# Altium schematic sheet Alimentacion.SchDoc
size A4
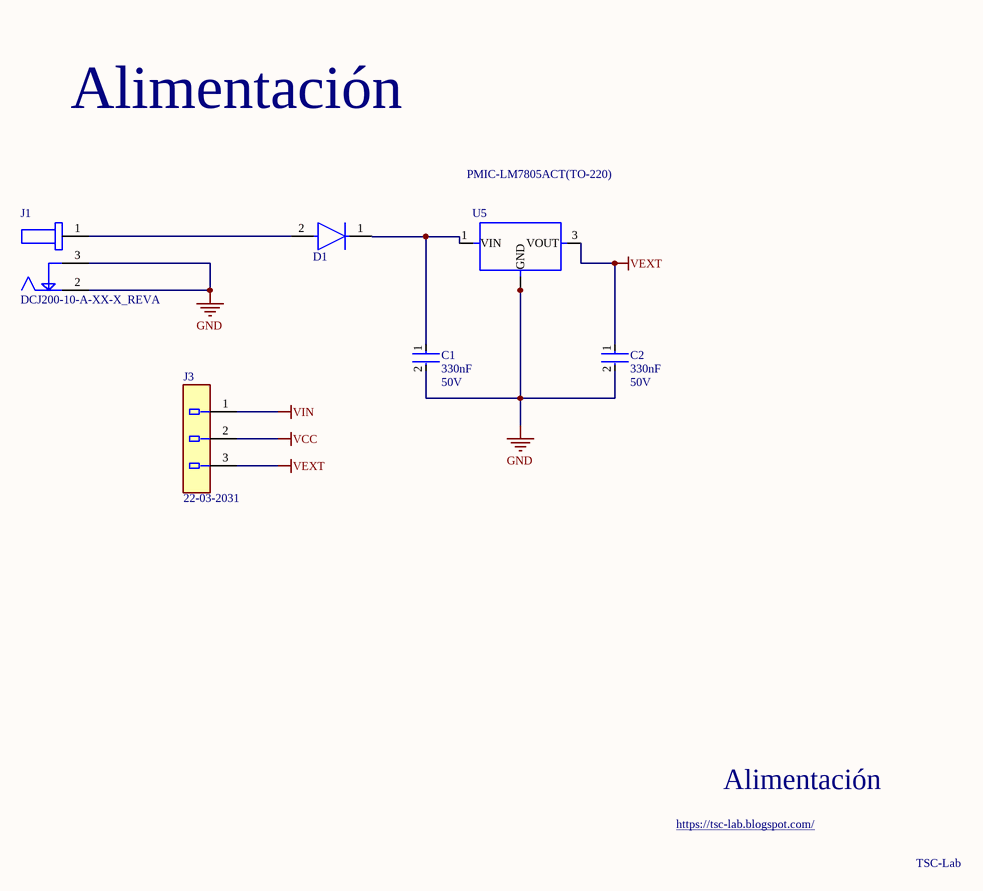
[diagram p0: Alimentacion.SchDoc]

## Parts
C1  Capacitance: 330nF  Voltage: 50V  [Kemet_C322C334M5U5TA7301_0]  (hidden comment: Cap_Kemet_C322C334M5U5TA7301_eec)
C2  Capacitance: 330nF  Voltage: 50V  [Kemet_C322C334M5U5TA7301_0]  (hidden comment: Cap_Kemet_C322C334M5U5TA7301_eec)
D1  Diode_Vishay_1N4001E-E3-54_eec  [Vishay_1N4001E-E3-54_0]  (value not drawn)
J1  DCJ200-10-A-XX-X_REVA  [GCT_DCJ200-10-A-XX-X_REVA]
J3  Part Number: 22-03-2031  [Molex_SD-4030-0001_0]  (hidden comment: Conn_Molex_22-03-2031_eec)
U5  PMIC-LM7805ACT(TO-220)  [TO-220]

## Nets
GND: C1.2 C2.2 J1.2 J1.3 U5.2(GND) U5.HEAT(GND)
VCC: J3.2
VEXT: C2.1 J3.3 U5.3(VOUT)
VIN: J3.1
NetC1_1: C1.1 D1.1(C) U5.1(VIN)
NetD1_2: D1.2(A) J1.1

## Notes on the sheet
- Alimentación
- https://tsc-lab.blogspot.com/
- TSC-Lab

## Library data of the parts
C1 C2 = Cap_Kemet_C322C334M5U5TA7301_eec: CAP CER 0.33UF 50V Z5U RADIAL; Manufacturer: Kemet; Value: 330nF; Part Number: C322C334M5U5TA7301; helpURL: https://upverter.com/upn/revision/a7e23f606e787d17/; ComponentLink2Description: Datasheet; Temperature: -10°C to +85°C; Package: AXIAL; Supplier 2: Mouser; Price: 0.206679296795; Supplier 1: Digi-Key; ComponentLink1URL: https://upverter.com/upn/revision/a7e23f606e787d17/; Supplier Part Number 2: 80-C322C334M5U-TR; Supplier Part Number 1: 399-9882-1-ND; ComponentLink1Description: Upverter; ComponentLink2URL: http://www.mouser.com/ds/2/212/KEM_C1051_GOLDMAX_Z5U-1140498.pdf; RoHS: TRUE; Mouser Part Number: 80-C322C334M5U-TR; Temperature Range High: +85°C; Digikey Description: CAP CER 0.33UF 50V Z5U RADIAL; Digikey Part Number: 399-9882-1-ND; Lead Free: yes; Temperature Range Low: -10°C
D1 = Diode_Vishay_1N4001E-E3-54_eec: DIODE GEN PURP 50V 1A DO204AL; Part Number: 1N4001E-E3/54; Manufacturer: Vishay; Diode Type: Standard; Voltage - Forward (Vf) (Max) @ If: 1.1V @ 1A; Capacitance @ Vr, F: 15pF @ 4V, 1MHz; Current - Reverse Leakage @ Vr: 5µA @ 50V; Speed: Standard Recovery >500ns, > 200mA (Io); Other Names: IN4001E-E3/54; helpURL: https://upverter.com/upn/revision/7d4f72d520b50cd6/; ComponentLink2Description: Datasheet; Temperature: -50°C to +150°C; Package: DO41; Supplier 2: Mouser; Supplier 1: Digi-Key; ComponentLink1URL: https://upverter.com/upn/revision/7d4f72d520b50cd6/; Supplier Part Number 2: 625-1N4001E-E3/54; Supplier Part Number 1: 1N4001E-E3/54GICT-ND; Voltage: 50V; ComponentLink1Description: Upverter; ComponentLink2URL: http://www.vishay.com/doc?88503; RoHS: TRUE; Mouser Part Number: 625-1N4001E-E3/54; Ipc Land Pattern Name: DIOAD852W85L465D235; Temperature Range High: +150°C; Digikey Description: DIODE GEN PURP 50V 1A DO204AL; Digikey Part Number: 1N4001E-E3/54GICT-ND; Standard Package: 5,500; Current - Average Rectified (Io): 1A; Lead Free: yes; Voltage - DC Reverse (Vr) (Max): 50V; Temperature Range Low: -50°C; Mounting Type: Through Hole; Packaging: Tape & Reel (TR)
J1 = DCJ200-10-A-XX-X_REVA: DC Power Jack, Thru-Hole, Horizontal, with Locating Pegs, D2.0mm; MF: {'manufacturer': u'Global Connector Technology'}; Price: None; Package: None; Availability: Unavailable; Value: *; MP: DCJ200-10-A-XX-X_REVA
J3 = Conn_Molex_22-03-2031_eec: CONN HEADER 3POS .100 VERT TIN; Manufacturer: Molex; Voltage: 150V; Circuits_Loaded: 3; Current___Maximum_per_Contact: 4.0A; Mfg Package Ident: SD-4030-0001; helpURL: https://upverter.com/upn/revision/895d404c69e3c851/; ComponentLink2Description: Datasheet; Temperature: -40°C to +80°C; Package: SD-4030-0001; Supplier 2: Mouser; Price: 0.17996592642; Supplier 1: Digi-Key; ComponentLink1URL: https://upverter.com/upn/revision/895d404c69e3c851/; Supplier Part Number 2: 538-22-03-2031; Supplier Part Number 1: WM4001-ND; ComponentLink1Description: Upverter; ComponentLink2URL: http://www.molex.com/pdm_docs/sd/022032031_sd.pdf; RoHS: TRUE; Mouser Part Number: 538-22-03-2031; Temperature Range High: +80°C; Flammability: 94V-0; Digikey Description: CONN HEADER 3POS .100 VERT TIN; Digikey Part Number: WM4001-ND; Type: connector; Lead Free: yes; Temperature Range Low: -40°C; Num Pins: 3
U5 = PMIC-LM7805ACT(TO-220): 310030049; MF: {'manufacturer': u'ON Semiconductor'}; MP: LM7805ACT; Value: *; Package: None; Price: None; Availability: Unavailable